# Altium schematic sheet Drivers.SchDoc
size A4; SheetNumber: 3; SheetTotal: 8
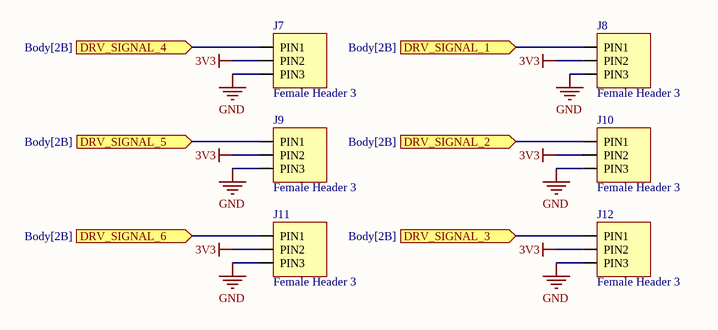
[diagram p0: Drivers.SchDoc]

## Parts
J7  Female Header 3  [FEMALE HEADER 3]
J8  Female Header 3  [FEMALE HEADER 3]
J9  Female Header 3  [FEMALE HEADER 3]
J10  Female Header 3  [FEMALE HEADER 3]
J11  Female Header 3  [FEMALE HEADER 3]
J12  Female Header 3  [FEMALE HEADER 3]

## Ports
DRV_SIGNAL_1 (in, see Body[2B]), DRV_SIGNAL_2 (in, see Body[2B]), DRV_SIGNAL_3 (in, see Body[2B]), DRV_SIGNAL_4 (in, see Body[2B]), DRV_SIGNAL_5 (in, see Body[2B]), DRV_SIGNAL_6 (in, see Body[2B])

## Nets
3V3: J7.PIN2 J8.PIN2 J9.PIN2 J10.PIN2 J11.PIN2 J12.PIN2
GND: J7.PIN3 J8.PIN3 J9.PIN3 J10.PIN3 J11.PIN3 J12.PIN3
DRV_SIGNAL_1: J8.PIN1 ; port DRV_SIGNAL_1
DRV_SIGNAL_2: J10.PIN1 ; port DRV_SIGNAL_2
DRV_SIGNAL_3: J12.PIN1 ; port DRV_SIGNAL_3
DRV_SIGNAL_4: J7.PIN1 ; port DRV_SIGNAL_4
DRV_SIGNAL_5: J9.PIN1 ; port DRV_SIGNAL_5
DRV_SIGNAL_6: J11.PIN1 ; port DRV_SIGNAL_6

## Library data of the parts
J7-J12 = Female Header 3: Number of Contacts: 3; System: Connector